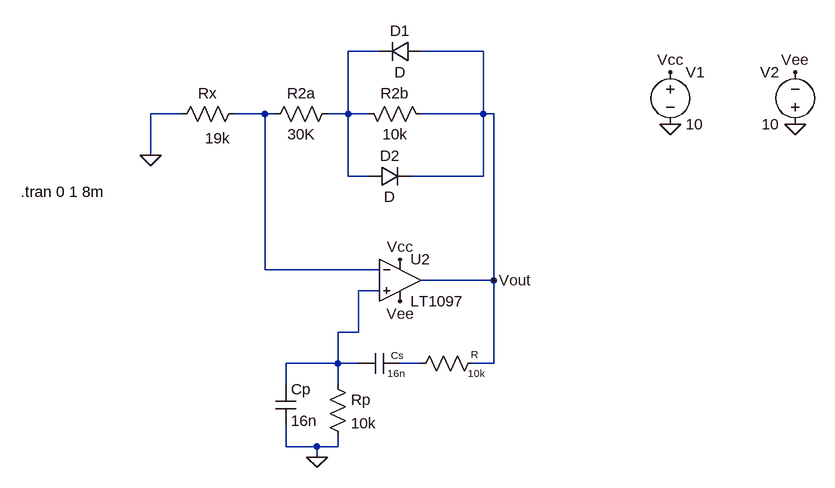
[diagram p0: schematic Ask3.asc]
Ask3.asc, the LTspice schematic file:
Version 4
SHEET 1 880 680
WIRE 128 -176 80 -176
WIRE 288 -176 192 -176
WIRE -176 -80 -224 -80
WIRE -48 -80 -96 -80
WIRE -32 -80 -48 -80
WIRE 80 -80 80 -176
WIRE 80 -80 48 -80
WIRE 112 -80 80 -80
WIRE 288 -80 288 -176
WIRE 288 -80 192 -80
WIRE 304 -80 288 -80
WIRE -224 -16 -224 -80
WIRE 80 16 80 -80
WIRE 112 16 80 16
WIRE 288 16 288 -80
WIRE 288 16 176 16
WIRE -48 160 -48 -80
WIRE 128 160 -48 160
WIRE 304 176 304 -80
WIRE 304 176 192 176
WIRE 128 192 96 192
WIRE 96 256 96 192
WIRE 96 256 64 256
WIRE 64 304 64 256
WIRE 64 304 -16 304
WIRE 96 304 64 304
WIRE 192 304 160 304
WIRE 304 304 304 176
WIRE 304 304 272 304
WIRE -16 336 -16 304
WIRE 64 336 64 304
WIRE -16 432 -16 400
WIRE 32 432 -16 432
WIRE 64 432 64 416
WIRE 64 432 32 432
WIRE 32 448 32 432
FLAG 32 448 0
FLAG -224 -16 0
FLAG 576 -64 0
FLAG 576 -144 Vcc
FLAG 160 144 Vcc
FLAG 768 -64 0
FLAG 768 -144 Vee
FLAG 160 208 Vee
FLAG 304 176 Vout
SYMBOL res 48 320 R0
SYMATTR InstName Rp
SYMATTR Value 10k
SYMBOL cap -32 336 R0
SYMATTR InstName Cp
SYMATTR Value 16n
SYMBOL cap 160 288 R90
WINDOW 0 14 4 VBottom 1
WINDOW 3 21 6 VTop 1
SYMATTR InstName Cs
SYMATTR Value 16n
SYMBOL res 288 288 R90
WINDOW 0 12 13 VBottom 1
WINDOW 3 21 11 VTop 1
SYMATTR InstName R
SYMATTR Value 10k
SYMBOL res 96 -96 M90
WINDOW 0 0 56 VBottom 2
WINDOW 3 32 56 VTop 2
SYMATTR InstName R2b
SYMATTR Value 10k
SYMBOL diode 192 -192 R90
WINDOW 0 0 32 VBottom 2
WINDOW 3 32 32 VTop 2
SYMATTR InstName D1
SYMBOL diode 112 32 R270
WINDOW 0 32 32 VTop 2
WINDOW 3 0 32 VBottom 2
SYMATTR InstName D2
SYMBOL res -80 -96 R90
WINDOW 0 0 56 VBottom 2
WINDOW 3 38 41 VTop 2
SYMATTR InstName Rx
SYMATTR Value 19k
SYMBOL res 64 -96 R90
WINDOW 0 0 56 VBottom 2
WINDOW 3 32 56 VTop 2
SYMATTR InstName R2a
SYMATTR Value 30K
SYMBOL OpAmps\\LT1097 160 112 R0
SYMATTR InstName U2
SYMBOL voltage 576 -160 R0
SYMATTR InstName V1
SYMATTR Value 10
SYMBOL voltage 768 -48 R180
WINDOW 0 24 96 Left 2
WINDOW 3 24 16 Left 2
SYMATTR InstName V2
SYMATTR Value 10
TEXT -424 40 Left 2 !.tran 0 1 8m

The netlist it stands for:
* Ask3.asc
Rp N003 0 10k
Cp N003 0 16n
Cs N004 N003 16n
R Vout N004 10k
R2b N001 Vout 10k
D1 Vout N001 D
D2 N001 Vout D
Rx N002 0 19k
R2a N001 N002 30K
XU2 N003 N002 Vcc Vee Vout LT1097  ; pins In+ In- V+ V- OUT
V1 Vcc 0 10
V2 0 Vee 10
.model D D
.lib standard.dio
.tran 0 1 8m
.backanno
.end